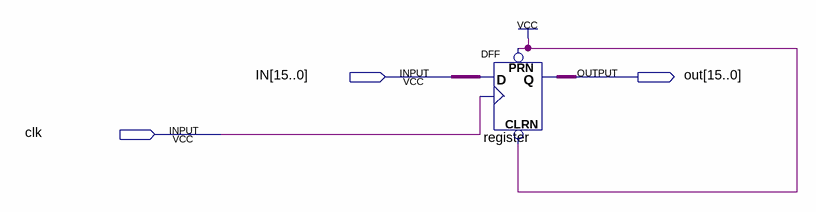
[diagram p0: schematic sheet]
// Quartus schematic register.bdf as structural Verilog: 1 symbols, 3 pins
module register (
  input  [15:0] IN,
  input  clk,
  output [15:0] out
);

  DFF register[15:0] (.CLRN(1'b1), .CLK(clk), .D(IN), .PRN(1'b1), .Q(out));
endmodule
